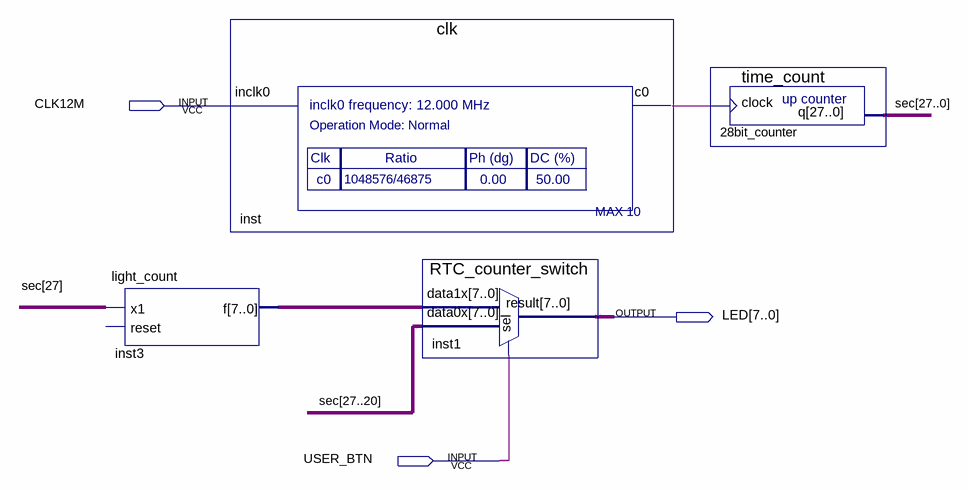
[diagram p0: schematic sheet]
// Quartus schematic timer.bdf as structural Verilog: 4 symbols, 3 pins
module timer (
  input  CLK12M,
  input  USER_BTN,
  output [7:0] LED
);

  wire inst_c0;
  wire [7:0] inst3_f;
  wire [27:0] sec;

  light_count inst3 (.x1(sec[27]), .f(inst3_f));  // open: reset
  clk inst (.inclk0(CLK12M), .c0(inst_c0));
  RTC_counter_switch inst1 (.data1x(inst3_f), .data0x(sec[27:20]), .sel(USER_BTN), .result(LED));
  time_count u_28bit_counter (.clock(inst_c0), .q(sec));
endmodule
